# Altium schematic sheet Precharge_Fail.SchDoc
size A
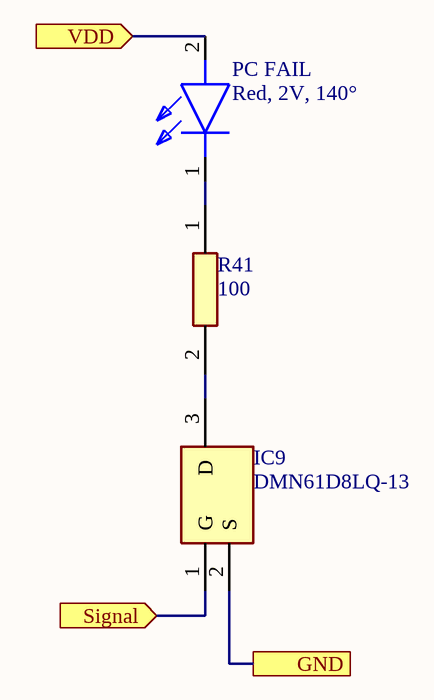
[diagram p0: Precharge_Fail.SchDoc]

## Parts
IC9  DMN61D8LQ-13  [SOT96P240X110-3N]
PC_FAIL  Red, 2V, 140°  [LEDC1608X70N]
R41  100  [RESC1608X55N]

## Ports
GND, Signal (in), VDD (in)

## Nets
GND: IC9.2(S) ; port GND
Signal: IC9.1(G) ; port Signal
VDD: PC_FAIL.2(A) ; port VDD
NetIC9_3: IC9.3(D) R41.2
NetPC_FAIL_1: PC_FAIL.1(K) R41.1

## Library data of the parts
IC9 = DMN61D8LQ-13: Integrated Circuit; Manufacturer_Name: Diodes Incorporated; Datasheet Link: https://www.diodes.com//assets/Datasheets/DMN61D8LQ.pdf; Height: 1.1mm; Manufacturer_Part_Number: DMN61D8LQ-13; Mouser Part Number: 621-DMN61D8LQ-13; Mouser Price/Stock: https://www.mouser.co.uk/ProductDetail/Diodes-Incorporated/DMN61D8LQ-13?qs=DBvH5xl4UymJgoulTjiNCg%3D%3D; Arrow Part Number: DMN61D8LQ-13; Arrow Price/Stock: https://www.arrow.com/en/products/dmn61d8lq-13/diodes-incorporated?utm_currency=USD&region=nac
PC_FAIL = 150060RS75000: LED; Manufacturer_Name: Wurth Elektronik; Datasheet Link: https://www.we-online.com/catalog/datasheet/150060RS75000.pdf; Height: 0.7mm; Manufacturer_Part_Number: 150060RS75000; Mouser Part Number: 710-150060RS75000; Mouser Price/Stock: https://www.mouser.co.uk/ProductDetail/Wurth-Elektronik/150060RS75000?qs=LlUlMxKIyB3QnmZ3fw%2FVCA%3D%3D
R41 = RC0603JR-7W100RL: Resistor; Manufacturer_Name: Yageo Group; Datasheet Link: http://www.yageo.com/documents/recent/PYu-RC0603_51_RoHS_L_v5.pdf; Height: 0.55mm; Manufacturer_Part_Number: RC0603JR-7W100RL; Mouser Part Number: 603-RC0603JR-7W100RL; Mouser Price/Stock: https://www.mouser.co.uk/ProductDetail/YAGEO/RC0603JR-7W100RL?qs=tggtontpCXNb6PZs9ghEpg%3D%3D; Arrow Part Number: RC0603JR-7W100RL; Arrow Price/Stock: https://www.arrow.com/en/products/rc0603jr-7w100rl/yageo?region=nac